# Altium schematic sheet boxer_main.SchDoc: Schemat blokowy
size A4; DrawnBy: Damian Dolewski; Engineer: Damian Dolewski; DocumentNumber: 1; SheetNumber: 1; SheetTotal: 7
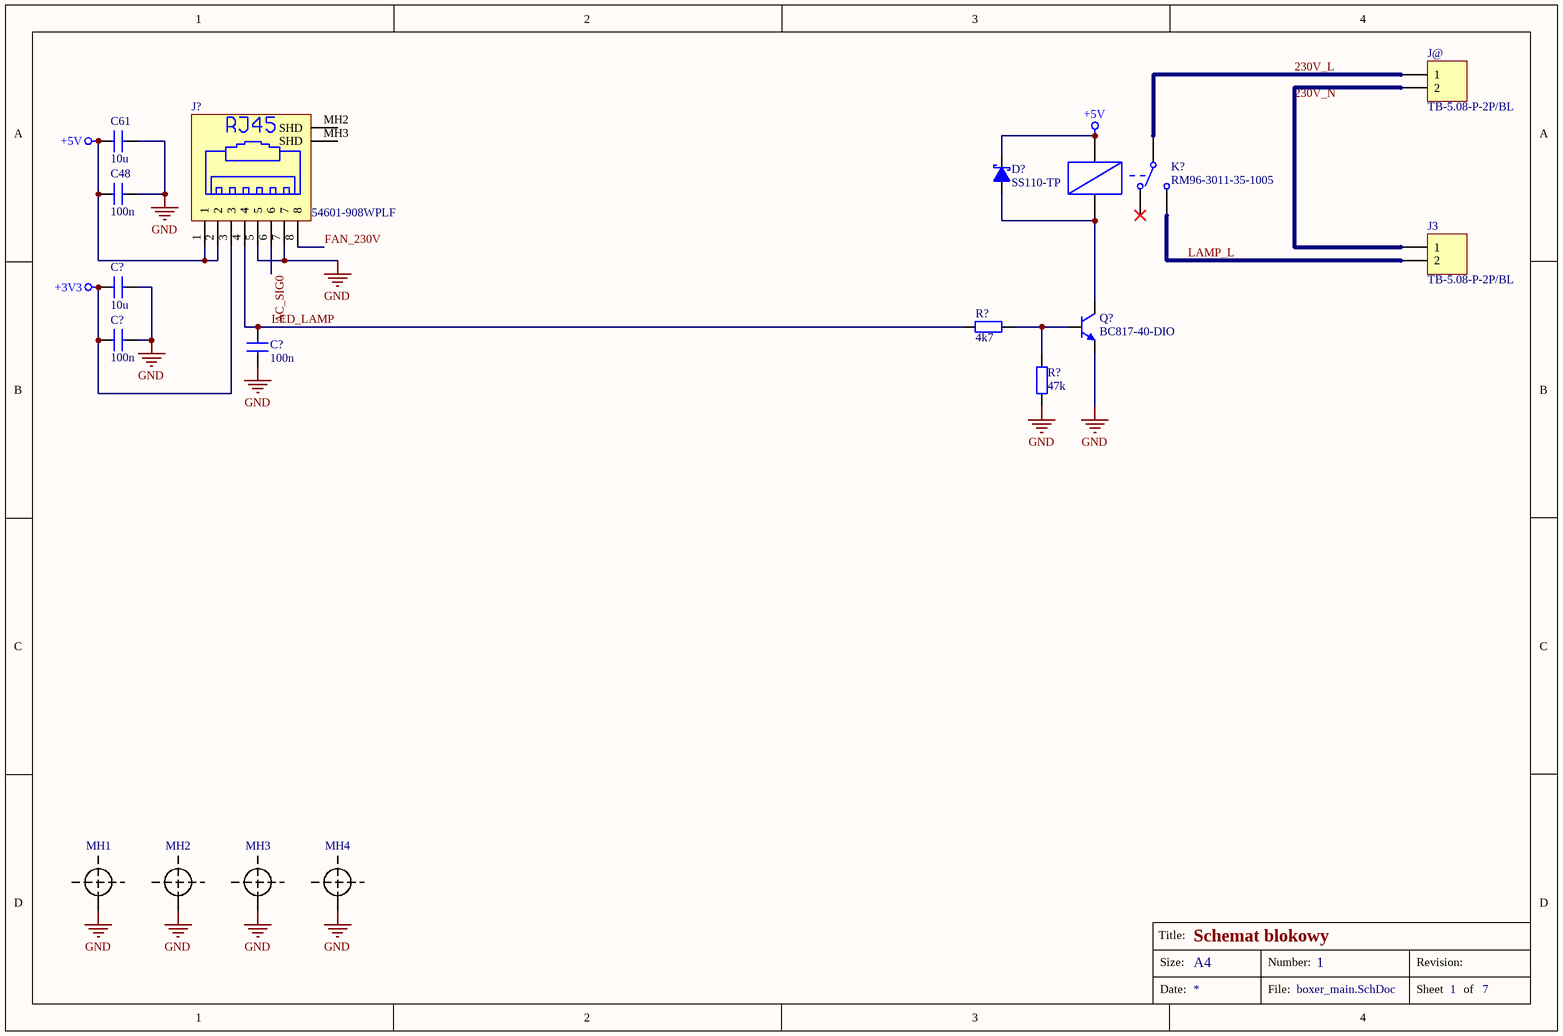
[diagram p0: boxer_main.SchDoc]

## Parts
(Parts that share a designator on the sheet are numbered #1, #2 ... from top to bottom, then left to right.)
C48  value 100n  [C_0805]  (hidden comment: Capacitor)
C61  value 10u  [C_1206]  (hidden comment: Capacitor)
C?#1  value 10u  [C_1206]  (hidden comment: Capacitor)
C?#2  value 100n  [C_0805]  (hidden comment: Capacitor)
C?#3  value 100n  [C_0805]  (hidden comment: Capacitor)
D?  SS110-TP  [D_SMA]
J3  TB-5.08-P-2P/BL  [NINIGI TB-5.08 2pin]
J?  54601-908WPLF  [RJ45_54601-908WPLF]
J@  TB-5.08-P-2P/BL  [NINIGI TB-5.08 2pin]
K?  RM96-3011-35-1005  [RM96_1P]
MH1  Mounting hole  [MH_M2.5]  (value not drawn)
MH2  Mounting hole  [MH_M2.5]  (value not drawn)
MH3  Mounting hole  [MH_M2.5]  (value not drawn)
MH4  Mounting hole  [MH_M2.5]  (value not drawn)
Q?  BC817-40-DIO  [TO-92]
R?#1  value 4k7  [R_0805]  (hidden comment: Resistor)
R?#2  value 47k  [R_0805]  (hidden comment: Resistor)

## Nets
+3V3: C?#1.2 C?#3.2 J?.3
+5V: C48.2 C61.2 D?.2(K) J?.1 J?.2 K?.A1
GND: C48.1 C61.1 C?#1.1 C?#2.2 C?#3.1 J?.5 J?.7 MH1.MH MH2.MH MH3.MH MH4.MH Q?.2(E) R?#2.1
230V_L: J@.1 K?.11
230V_N: J3.1 J@.2
AC_SIG0: J?.6
FAN_230V: J?.8
LAMP_L: J3.2 K?.14
LED_LAMP: C?#2.1 J?.4 R?#1.1
NetD?_1: D?.1(A) K?.A2 Q?.3(C)
NetQ?_1: Q?.1(B) R?#1.2 R?#2.2

Not connected (* = marked no-connect by the designer): J? MH2(SHD) MH3(SHD); K? 12*

## Notes on the sheet
- Title:
- Size:
- A4
- Number:
- Revision:
- Date:
- File:
- Sheet
- of

## Library data of the parts
D? = Diode Schottky: Schottky Diode; Value: SS110-TP
J3 J@ = Header 2: Terminal Block; Value: TB-5.08-P-2P/BL
J? = RJ45-8: RJ45 Socket, 8pin, No Key, Molex MX-95001-2881; Value: 54601-908WPLF
K? = Relay: Electromagnetic Relay; Value: RM96-3011-35-1005
MH1-MH4 = Mounting hole: Mounting hole 2.3mm
Q? = NPN: NPN Bipolar Transistor; Value: BC817-40-DIO